# EAGLE board RT5350F_OLinuXino_Balun_Rev-A (EAGLE 4.16), part 1 of 2
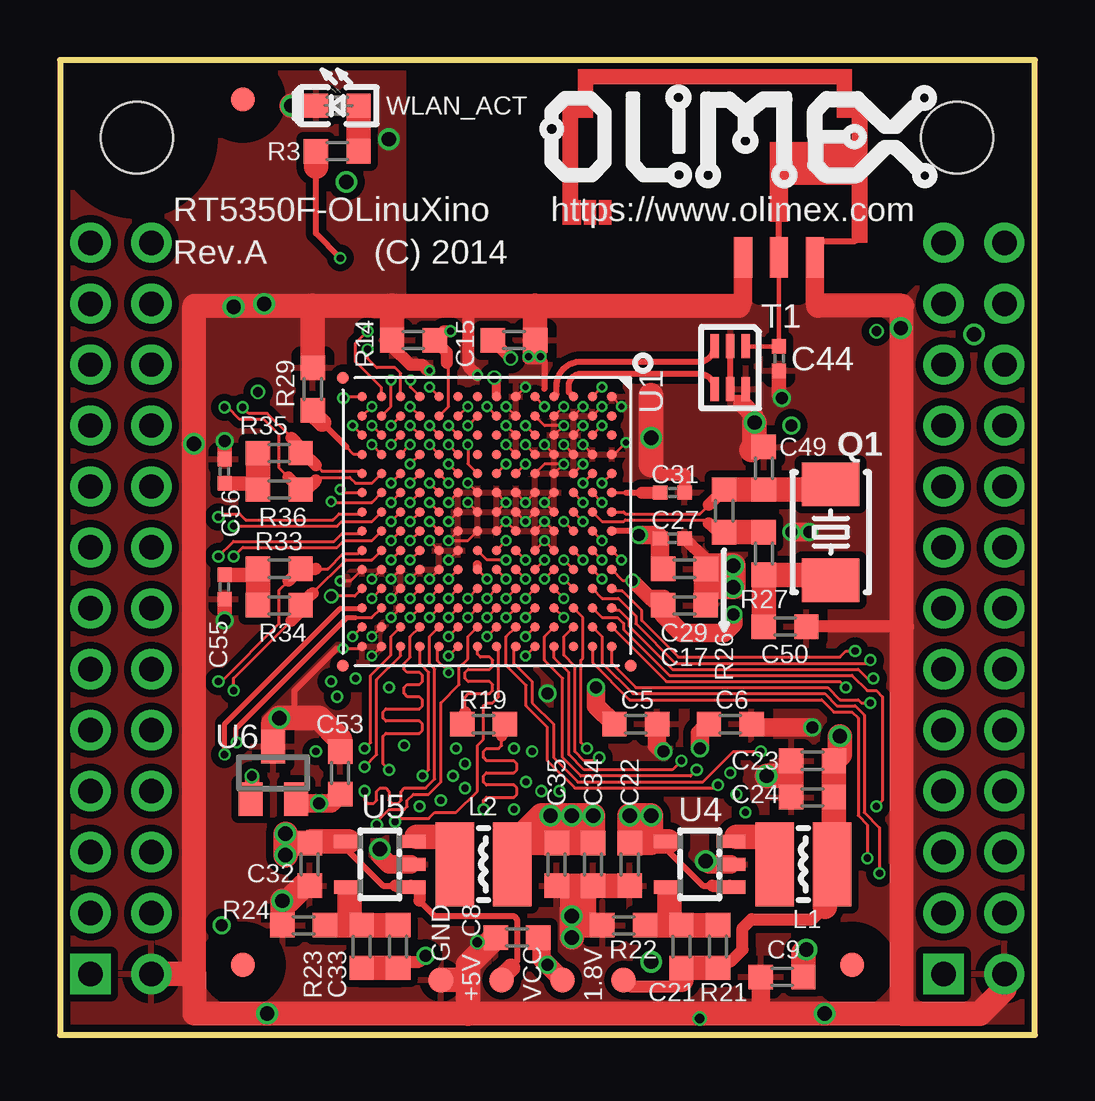
[diagram p2: board, top side]
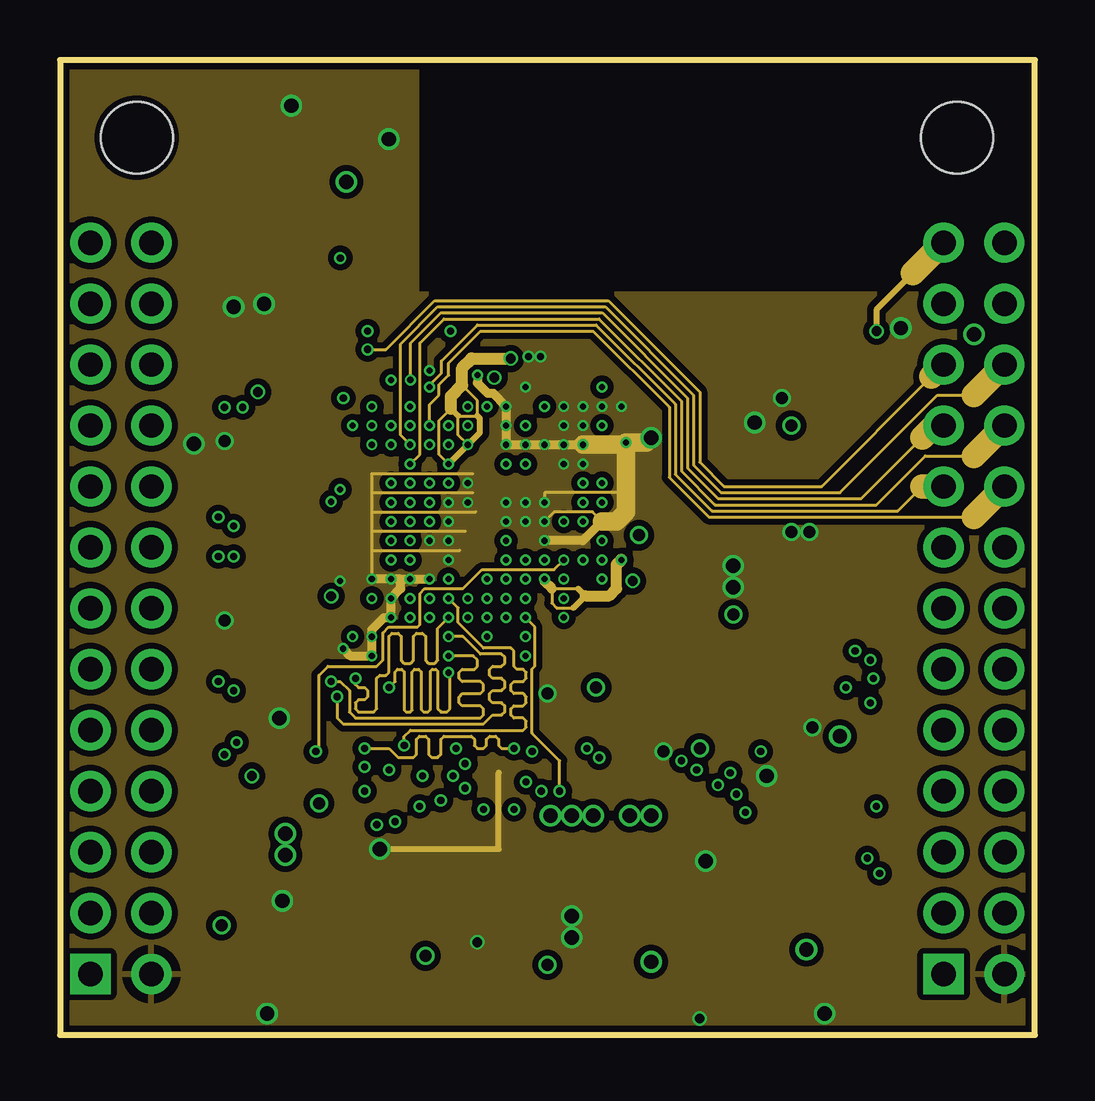
[diagram p3: board, inner layer GND]
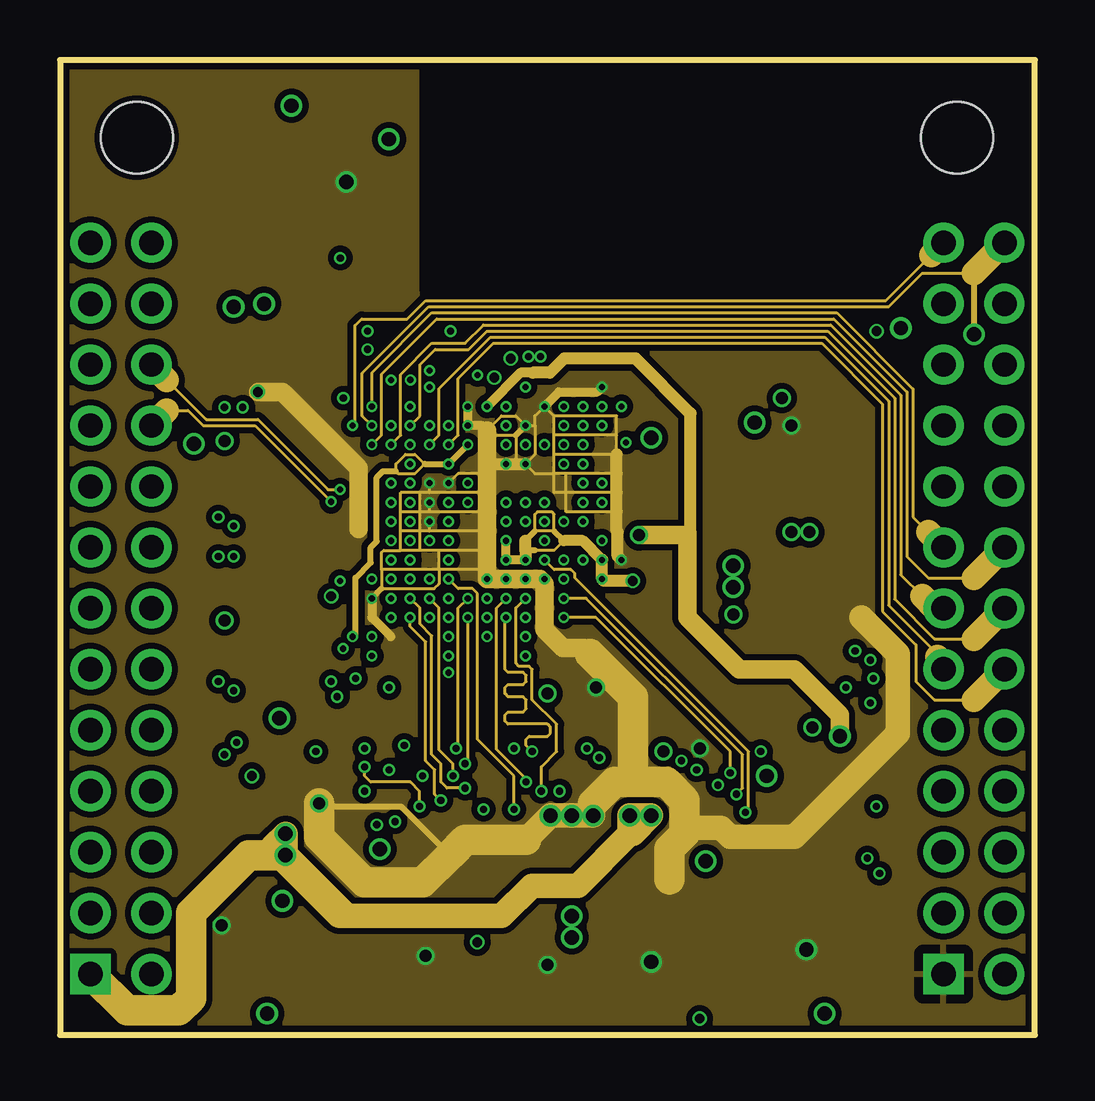
[diagram p4: board, inner layer PWR]
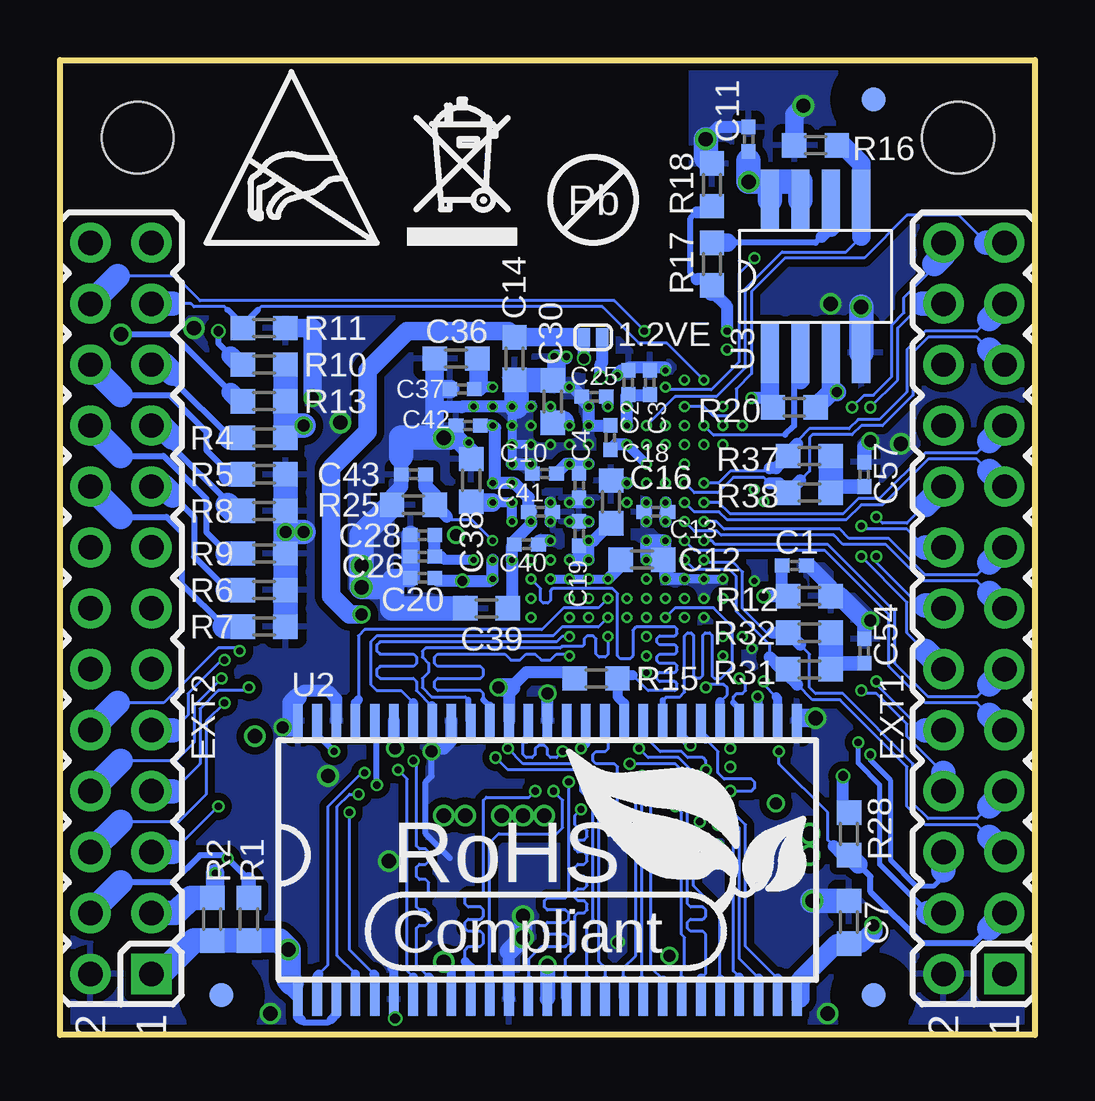
[diagram p5: board, bottom side, seen from below]

Size 40.64 x 40.64 mm. Coordinates in mm from the lower left corner, seen from the top.
Outline: 0,0 40.64,0 40.64,40.64 0,40.64 0,0
Copper layers (1+2*15+16): Top 0.035mm / dielectric 0.127mm / GND 0.035mm / dielectric 1.1mm / PWR 0.035mm / dielectric 0.127mm / Bottom 0.035mm
Design rules "default": minimum track width 4mil, minimum drill 0.2mm, track to track 5mil, track to pad 5mil, pad to pad 5mil, via to via 5mil, smd to smd 1mil, copper to edge 10mil, drill to drill 8mil, minimum pad ring 6mil, minimum via ring 4mil, stop-mask expansion 4mil, vias tented up to drill 28mil, thermal gap 15mil
Holes 3 mm at 3.2,37.4 37.4,37.4
tRestrict: area 34.4,34.4 to 40.4,40.4; area 0.2,34.4 to 6.2,40.4; 5 lines
bRestrict: area 0.2,34.4 to 6.2,40.4; area 34.4,34.4 to 40.4,40.4; 6 lines

## Footprints (pad centres in the part's own frame; a part is rotated, then mirrored left to right if it is on the bottom)
SJ_1_SMALLER = smd 0.508 x 0.762: 1 -0.381,0; 2 0.381,0
TESTPAD_40-ROUND = smd 1.016 x 1.016: 1 0,0
WIFI_RTL8188_ANT = smd 1.676 x 0.762: ANT -3.404,0; GND1 -3.404,1.499; GND2 -3.404,-1.499
C0402_TI = smd 0.61 x 0.584: 1 -0.508,0; 2 0.508,0
C0603_DWS@1 = smd 1.016 x 1.016: 1 -0.889,0; 2 0.889,0
C0603_DWS = smd 1.016 x 1.016: 1 -0.889,0; 2 0.889,0
HN2X13-MALE = drill 1.016 pad 1.676 square: 1 -15.24,-1.27 | drill 1.016 pad 1.676 round: 2 -15.24,1.27; 3 -12.7,-1.27; 4 -12.7,1.27; 5 -10.16,-1.27; 6 -10.16,1.27; 7 -7.62,-1.27; 8 -7.62,1.27; 9 -5.08,-1.27; 10 -5.08,1.27; 11 -2.54,-1.27; 12 -2.54,1.27; 13 0,-1.27; 14 0,1.27; 15 2.54,-1.27; 16 2.54,1.27; 17 5.08,-1.27; 18 5.08,1.27; 19 7.62,-1.27; 20 7.62,1.27; 21 10.16,-1.27; 22 10.16,1.27; 23 12.7,-1.27; 24 12.7,1.27; 25 15.24,-1.27; 26 15.24,1.27
FIDUCIAL-1X3 = smd 1 x 1: 1 0,0
CD32 = smd 1.6 x 3.5: 1 -1.2,0; 2 1.2,0
HCX-4S = smd 1.8 x 2.4: 1 -2,0; 2 2,0
R0603_5MIL_DWS = smd 1.016 x 1.016: 1 -0.889,0; 2 0.889,0
2450BM15A0002 = smd 0.35 x 1: 1 -0.65,-0.9; 2 0,-0.9; 3 0.65,-0.9; 4 0.65,0.9; 5 0,0.9; 6 -0.65,0.9
TFBGA196B = smd 0.4 x 0.4: A1 -5.2,-5.2; A2 -5.2,-4.4; A3 -5.2,-3.6; A4 -5.2,-2.8; A5 -5.2,-2; A6 -5.2,-1.2; A7 -5.2,-0.4; A8 -5.2,0.4; A9 -5.2,1.2; A10 -5.2,2; A11 -5.2,2.8; A12 -5.2,3.6; A13 -5.2,4.4; A14 -5.2,5.2; B1 -4.4,-5.2; B2 -4.4,-4.4; B3 -4.4,-3.6; B4 -4.4,-2.8; B5 -4.4,-2; B6 -4.4,-1.2; B7 -4.4,-0.4; B8 -4.4,0.4; B9 -4.4,1.2; B10 -4.4,2; B11 -4.4,2.8; B12 -4.4,3.6; B13 -4.4,4.4; B14 -4.4,5.2; C1 -3.6,-5.2; C2 -3.6,-4.4; C3 -3.6,-3.6; C4 -3.6,-2.8; C5 -3.6,-2; C6 -3.6,-1.2; C7 -3.6,-0.4; C8 -3.6,0.4; C9 -3.6,1.2; C10 -3.6,2; C11 -3.6,2.8; C12 -3.6,3.6; C13 -3.6,4.4; C14 -3.6,5.2; D1 -2.8,-5.2; D2 -2.8,-4.4; D3 -2.8,-3.6; D4 -2.8,-2.8; D5 -2.8,-2; D6 -2.8,-1.2; D7 -2.8,-0.4; D8 -2.8,0.4; D9 -2.8,1.2; D10 -2.8,2; D11 -2.8,2.8; D12 -2.8,3.6; D13 -2.8,4.4; D14 -2.8,5.2; E1 -2,-5.2; E2 -2,-4.4; E3 -2,-3.6; E4 -2,-2.8; E5 -2,-2; E6 -2,-1.2; E7 -2,-0.4; E8 -2,0.4; E9 -2,1.2; E10 -2,2; E11 -2,2.8; E12 -2,3.6; E13 -2,4.4; E14 -2,5.2; F1 -1.2,-5.2; F2 -1.2,-4.4; F3 -1.2,-3.6; F4 -1.2,-2.8; F5 -1.2,-2; F6 -1.2,-1.2; F7 -1.2,-0.4; F8 -1.2,0.4; F9 -1.2,1.2; F10 -1.2,2; F11 -1.2,2.8; F12 -1.2,3.6; F13 -1.2,4.4; F14 -1.2,5.2; G1 -0.4,-5.2; G2 -0.4,-4.4; G3 -0.4,-3.6; G4 -0.4,-2.8; G5 -0.4,-2; G6 -0.4,-1.2; G7 -0.4,-0.4; G8 -0.4,0.4; G9 -0.4,1.2; G10 -0.4,2; G11 -0.4,2.8; G12 -0.4,3.6; G13 -0.4,4.4; G14 -0.4,5.2; H1 0.4,-5.2; H2 0.4,-4.4; H3 0.4,-3.6; H4 0.4,-2.8; H5 0.4,-2; H6 0.4,-1.2; H7 0.4,-0.4; H8 0.4,0.4; H9 0.4,1.2; H10 0.4,2; H11 0.4,2.8; H12 0.4,3.6; H13 0.4,4.4; H14 0.4,5.2; J1 1.2,-5.2; J2 1.2,-4.4; J3 1.2,-3.6; J4 1.2,-2.8; J5 1.2,-2; J6 1.2,-1.2; J7 1.2,-0.4; J8 1.2,0.4; J9 1.2,1.2; J10 1.2,2; J11 1.2,2.8; J12 1.2,3.6; J13 1.2,4.4; J14 1.2,5.2; K1 2,-5.2; K2 2,-4.4; K3 2,-3.6; K4 2,-2.8; K5 2,-2; K6 2,-1.2; K7 2,-0.4; K8 2,0.4; K9 2,1.2; K10 2,2; K11 2,2.8; K12 2,3.6; K13 2,4.4; K14 2,5.2; L1 2.8,-5.2; L2 2.8,-4.4; L3 2.8,-3.6; L4 2.8,-2.8; L5 2.8,-2; L6 2.8,-1.2; L7 2.8,-0.4; L8 2.8,0.4; L9 2.8,1.2; L10 2.8,2; L11 2.8,2.8; L12 2.8,3.6; L13 2.8,4.4; L14 2.8,5.2; M1 3.6,-5.2; M2 3.6,-4.4; M3 3.6,-3.6; M4 3.6,-2.8; M5 3.6,-2; M6 3.6,-1.2; M7 3.6,-0.4; M8 3.6,0.4; M9 3.6,1.2; M10 3.6,2; M11 3.6,2.8; M12 3.6,3.6; M13 3.6,4.4; M14 3.6,5.2; N1 4.4,-5.2; N2 4.4,-4.4; N3 4.4,-3.6; N4 4.4,-2.8; N5 4.4,-2; N6 4.4,-1.2; N7 4.4,-0.4; N8 4.4,0.4; N9 4.4,1.2; N10 4.4,2; N11 4.4,2.8; N12 4.4,3.6; N13 4.4,4.4; N14 4.4,5.2; P1 5.2,-5.2; P2 5.2,-4.4; P3 5.2,-3.6; P4 5.2,-2.8; P5 5.2,-2; P6 5.2,-1.2; P7 5.2,-0.4; P8 5.2,0.4; P9 5.2,1.2; P10 5.2,2; P11 5.2,2.8; P12 5.2,3.6; P13 5.2,4.4; P14 5.2,5.2 | smd 0.5 x 0.5: FID1 6,-6; FID2 -6,6; FID3 6,6
54TSOPII = smd 0.4 x 1.4: 1 -10.4,-6; 2 -9.6,-6; 3 -8.8,-6; 4 -8,-6; 5 -7.2,-6; 6 -6.4,-6; 7 -5.6,-6; 8 -4.8,-6; 9 -4,-6; 10 -3.2,-6; 11 -2.4,-6; 12 -1.6,-6; 13 -0.8,-6; 14 0,-6; 15 0.8,-6; 16 1.6,-6; 17 2.4,-6; 18 3.2,-6; 19 4,-6; 20 4.8,-6; 21 5.6,-6; 22 6.4,-6; 23 7.2,-6; 24 8,-6; 25 8.8,-6; 26 9.6,-6; 27 10.4,-6; 28 10.4,5.6; 29 9.6,5.6; 30 8.8,5.6; 31 8,5.6; 32 7.2,5.6; 33 6.4,5.6; 34 5.6,5.6; 35 4.8,5.6; 36 4,5.6; 37 3.2,5.6; 38 2.4,5.6; 39 1.6,5.6; 40 0.8,5.6; 41 0,5.6; 42 -0.8,5.6; 43 -1.6,5.6; 44 -2.4,5.6; 45 -3.2,5.6; 46 -4,5.6; 47 -4.8,5.6; 48 -5.6,5.6; 49 -6.4,5.6; 50 -7.2,5.6; 51 -8,5.6; 52 -8.8,5.6; 53 -9.6,5.6; 54 -10.4,5.6
SO8_ATMEL_FLASH = smd 0.762 x 2.54: 1 -1.905,-3.175; 2 -0.635,-3.175; 3 0.635,-3.175; 4 1.905,-3.175; 5 1.905,3.175; 6 0.635,3.175; 7 -0.635,3.175; 8 -1.905,3.175
SOT23-5 = smd 1.2 x 0.55: 1 1.3,-0.95; 2 1.3,0; 3 1.3,0.95; 4 -1.3,0.95; 5 -1.3,-0.95
SOT23 = smd 1 x 1.4: 1 -0.95,-1.1; 2 0.95,-1.1; 3 0,1.1
LED-0603 = smd 1.016 x 1.016: A 0.889,0; C -0.889,0

## Placement (x,y rotation side)
1.2VE  Close  [SJ_1_SMALLER]  18.41,29.08 0 bottom
1.8V  TESTPADTESTPAD_40-ROUND  [TESTPAD_40-ROUND]  23.5,2.29 270 top
+5V  TESTPADTESTPAD_40-ROUND  [TESTPAD_40-ROUND]  18.41,2.29 180 top
ANT  WIFI_RTL8188_ANTENNA  [WIFI_RTL8188_ANT]  29.97,35.81 90 top
C1  100nF  [C0402_TI]  10.03,19.57 0 bottom
C2  100nF  [C0402_TI]  16.95,27.2 90 bottom
C3  100nF  [C0402_TI]  16.05,27.2 90 bottom
C4  100nF  [C0402_TI]  19,22.9 270 bottom
C5  100nF  [C0603_DWS@1]  24,12.95 0 top
C6  100nF  [C0603_DWS@1]  27.94,12.95 0 top
C7  100nF  [C0603_DWS@1]  7.75,4.7 90 bottom
C8  100nF  [C0603_DWS@1]  19.05,4.06 180 top
C9  22uF/6.3V  [C0603_DWS@1]  30.1,2.41 180 top
C10  100nF  [C0402_TI]  20.45,23.4 180 bottom
C11  NA(100nF)  [C0402_TI]  11.94,37.34 90 bottom
C12  1uF  [C0603_DWS@1]  16.38,19.81 0 bottom
C13  100nF  [C0402_TI]  15.8,21.8 180 bottom
C14  1uF  [C0603_DWS]  21.69,28.19 270 bottom
C15  1uF  [C0603_DWS@1]  18.92,28.96 0 top
C16  1uF  [C0603_DWS@1]  17.66,22.22 90 bottom
C17  1uF  [C0603_DWS@1]  26.04,17.91 0 top
C18  100nF  [C0402_TI]  17.7,24.9 90 bottom
C19  100nF  [C0402_TI]  19,20.9 90 bottom
C20  100nF  [C0402_TI]  25.53,19.05 180 bottom
C21  22pF  [C0603_DWS@1]  25.91,3.68 90 top
C22  22uF/6.3V  [C0603_DWS@1]  23.75,7.11 270 top
C23  22uF/6.3V  [C0603_DWS@1]  31.37,11.43 180 top
C24  22uF/6.3V  [C0603_DWS@1]  31.37,9.91 180 top
C25  100nF  [C0402_TI]  18.38,26.6 180 bottom
C26  100nF  [C0402_TI]  25.53,19.94 180 bottom
C27  100nF  [C0402_TI]  25.53,20.7 0 top
C28  10pF  [C0402_TI]  25.53,20.83 180 bottom
C29  1uF  [C0603_DWS@1]  26.04,19.43 0 top
C30  1uF  [C0603_DWS@1]  20.1,26.4 90 bottom
C31  22nF  [C0402_TI]  25.53,22.61 0 top
C32  22uF/6.3V  [C0603_DWS@1]  10.41,7.11 270 top
C33  22pF  [C0603_DWS@1]  14.1,3.68 90 top
C34  22uF/6.3V  [C0603_DWS@1]  22.23,7.11 270 top
C35  22uF/6.3V  [C0603_DWS@1]  20.7,7.11 270 top
C36  1uF  [C0603_DWS@1]  24.13,28.19 180 bottom
C37  10pF  [C0402_TI]  23.88,26.92 180 bottom
C38  1uF  [C0603_DWS@1]  23.5,23.11 90 bottom
C39  1uF  [C0603_DWS@1]  22.86,17.78 180 bottom
C40  100pF  [C0402_TI]  21.2,20.45 0 bottom
C41  10pF  [C0402_TI]  20.6,21.8 0 bottom
C42  100nF  [C0402_TI]  23.62,25.4 180 bottom
C43  100pF  [C0402_TI]  25.91,23.37 180 bottom
C44  NA  [C0402_TI]  29.97,28.19 90 top
C49  NA(27pF)  [C0603_DWS@1]  29.34,23.62 90 top
C50  27pF  [C0603_DWS@1]  30.23,17.02 0 top
C53  100nF  [C0603_DWS@1]  11.68,10.92 90 top
C54  100nF  [C0402_TI]  7.11,16 90 bottom
C55  100nF  [C0402_TI]  6.86,18.67 270 top
C56  100nF  [C0402_TI]  6.86,23.5 90 top
C57  100nF  [C0402_TI]  7.11,23.37 90 bottom
EXT1  HN2X13  [HN2X13-MALE]  2.54,17.78 90 bottom
EXT2  HN2X13  [HN2X13-MALE]  38.1,17.78 90 bottom
FID1  FIDUCIAL  [FIDUCIAL-1X3]  7.62,38.99 90 top
FID2  FIDUCIAL  [FIDUCIAL-1X3]  33.02,2.92 90 top
FID3  FIDUCIAL  [FIDUCIAL-1X3]  7.62,2.92 90 top
FID4  FIDUCIAL  [FIDUCIAL-1X3]  6.73,38.99 270 bottom
FID5  FIDUCIAL  [FIDUCIAL-1X3]  33.91,1.65 270 bottom
FID6  FIDUCIAL  [FIDUCIAL-1X3]  6.73,1.65 270 bottom
GND  TESTPADTESTPAD_40-ROUND  [TESTPAD_40-ROUND]  15.88,2.29 270 top
L1  2.2uH/1.5A/DCR<0.1R/CD32  [CD32]  30.99,7.11 0 top
L2  2.2uH/1.5A/DCR<0.1R/CD32  [CD32]  17.65,7.11 0 top
Q1  E4SB20.000F20E15(20MHz/20pF/20ppm/5x3.2mm)  [HCX-4S]  32.13,20.95 90 top
R1  2.2k  [R0603_5MIL_DWS]  32.77,4.83 270 bottom
R2  2.2k  [R0603_5MIL_DWS]  34.29,4.83 270 bottom
R3  2.2k  [R0603_5MIL_DWS]  11.56,36.83 180 top
R4  4.7k  [R0603_5MIL_DWS]  32.13,24.89 0 bottom
R5  4.7k  [R0603_5MIL_DWS]  32.13,23.37 0 bottom
R6  4.7k  [R0603_5MIL_DWS]  32.13,18.54 0 bottom
R7  4.7k  [R0603_5MIL_DWS]  32.13,17.02 0 bottom
R8  4.7k  [R0603_5MIL_DWS]  32.13,21.84 0 bottom
R9  4.7k  [R0603_5MIL_DWS]  32.13,20.07 0 bottom
R10  4.7k  [R0603_5MIL_DWS]  32.13,27.94 0 bottom
R11  4.7k  [R0603_5MIL_DWS]  32.13,29.46 0 bottom
R12  8.2k/1%  [R0603_5MIL_DWS]  9.4,18.29 0 bottom
R13  4.7k  [R0603_5MIL_DWS]  32.13,26.42 0 bottom
R14  4.7k  [R0603_5MIL_DWS]  14.73,28.96 180 top
R15  4.7k  [R0603_5MIL_DWS]  18.29,14.86 0 bottom
R16  4.7k  [R0603_5MIL_DWS]  9.14,37.08 0 bottom
R17  22R  [R0603_5MIL_DWS]  13.46,32.13 270 bottom
R18  4.7k  [R0603_5MIL_DWS]  13.46,35.43 90 bottom
R19  22R  [R0603_5MIL_DWS]  17.65,12.95 0 top
R20  NA(47k)  [R0603_5MIL_DWS]  10.03,26.16 180 bottom
R21  5.62k/1%  [R0603_5MIL_DWS]  27.43,3.68 90 top
R22  2.74k/1%  [R0603_5MIL_DWS]  23.5,4.57 180 top
R23  4.99k/1%  [R0603_5MIL_DWS]  12.57,3.68 90 top
R24  1.1k/1%  [R0603_5MIL_DWS]  10.16,4.57 180 top
R25  12k/1%  [R0603_5MIL_DWS]  25.91,22.1 0 bottom
R26  NA(1M)  [R0603_5MIL_DWS]  27.69,21.84 270 top
R27  330R  [R0603_5MIL_DWS]  29.34,20.07 270 top
R28  22R  [R0603_5MIL_DWS]  7.75,8.38 90 bottom
R29  9.1k/1%  [R0603_5MIL_DWS]  10.54,26.92 90 top
R31  49.9/1%  [R0603_5MIL_DWS]  9.4,15.24 0 bottom
R32  49.9/1%  [R0603_5MIL_DWS]  9.4,16.76 0 bottom
R33  49.9/1%  [R0603_5MIL_DWS]  9.14,19.43 180 top
R34  49.9/1%  [R0603_5MIL_DWS]  9.14,17.91 180 top
R35  49.9/1%  [R0603_5MIL_DWS]  9.14,24.26 180 top
R36  49.9/1%  [R0603_5MIL_DWS]  9.14,22.73 180 top
R37  49.9/1%  [R0603_5MIL_DWS]  9.4,24.13 0 bottom
R38  49.9/1%  [R0603_5MIL_DWS]  9.4,22.61 0 bottom
T1  2450BM15A0002  [2450BM15A0002]  27.94,27.81 180 top
U1  RT5350  [TFBGA196B]  17.8,21.4 180 top
U2  K4S561632C-TC/L75  [54TSOPII]  20.32,7.49 0 bottom
U3  EN25Q64-104HIP  [SO8_ATMEL_FLASH]  9.14,31.62 0 bottom
U4  SY8009AAAC(SOT23-5)  [SOT23-5]  26.67,7.11 0 top
U5  SY8009AAAC(SOT23-5)  [SOT23-5]  13.34,7.11 0 top
U6  MCP130T-300I/TT  [SOT23]  8.89,10.92 0 top
U$3  [PB_SMALL]  18.41,34.8 0 bottom
U$8  [RECYCLE_BIN1/8]  26.16,32.89 0 bottom
U$9  [ROHS]  26.8,3.43 0 bottom
U$10  [OLIMEX1_V]  37.72,35.18 0 top
U$11  [ESD_SYMBOL]  34.54,33.02 0 bottom
VCC  TESTPADTESTPAD_40-ROUND  [TESTPAD_40-ROUND]  20.95,2.29 270 top
WLAN_ACT  LED/Yellow/0603  [LED-0603]  11.56,38.73 0 top